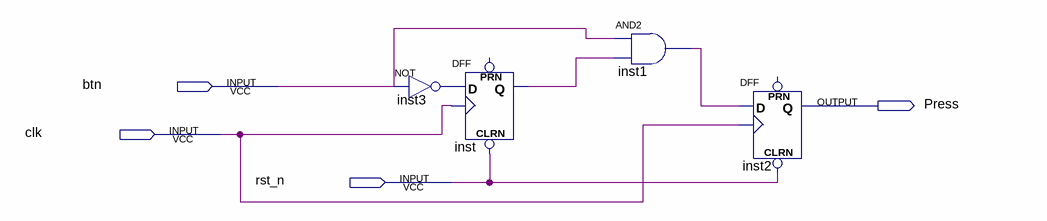
[diagram p0: schematic sheet]
// Quartus schematic press_detection.bdf as structural Verilog: 4 symbols, 4 pins
module press_detection (
  input  btn,
  input  clk,
  input  rst_n,
  output Press
);

  wire inst1_out, inst3_out, inst_q;

  not inst3 (inst3_out, btn);
  DFF inst (.CLRN(rst_n), .CLK(clk), .D(inst3_out), .Q(inst_q));  // open: PRN
  and inst1 (inst1_out, btn, inst_q);
  DFF inst2 (.CLRN(rst_n), .CLK(clk), .D(inst1_out), .Q(Press));  // open: PRN
endmodule
